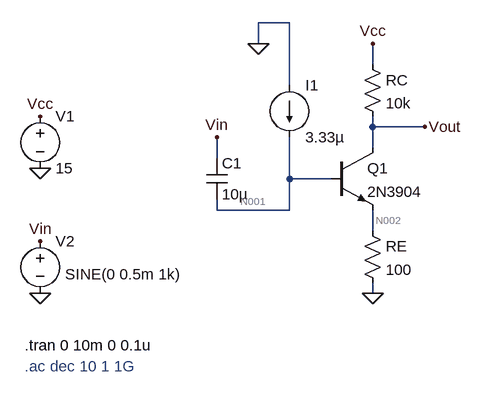
[diagram p0: schematic common_emitter_amplifier.asc]
common_emitter_amplifier.asc, the LTspice schematic file:
Version 4.1
SHEET 1 880 680
WIRE 208 -112 160 -112
WIRE 160 -80 160 -112
WIRE 336 -48 336 -80
WIRE 208 -16 208 -112
WIRE 336 48 336 32
WIRE 416 48 336 48
WIRE 336 80 336 48
WIRE 96 96 96 64
WIRE 208 128 208 64
WIRE 272 128 208 128
WIRE 96 176 96 160
WIRE 208 176 208 128
WIRE 208 176 96 176
WIRE 336 208 336 176
WIRE 336 304 336 288
FLAG -176 224 Vin
FLAG -176 32 Vcc
FLAG -176 304 0
FLAG -176 112 0
FLAG 336 -80 Vcc
FLAG 336 304 0
FLAG 160 -80 0
FLAG 96 64 Vin
FLAG 416 48 Vout
SYMBOL voltage -176 16 R0
WINDOW 123 0 0 Left 0
WINDOW 39 0 0 Left 0
SYMATTR InstName V1
SYMATTR Value 15
SYMBOL voltage -176 208 R0
WINDOW 123 38 117 Left 2
WINDOW 39 0 0 Left 0
WINDOW 3 38 67 Left 2
SYMATTR InstName V2
SYMATTR Value SINE(0 0.5m 1k)
SYMBOL npn 272 80 R0
SYMATTR InstName Q1
SYMATTR Value 2N3904
SYMBOL res 320 -64 R0
SYMATTR InstName RC
SYMATTR Value 10k
SYMBOL current 208 -16 R0
WINDOW 123 0 0 Left 0
WINDOW 39 0 0 Left 0
SYMATTR InstName I1
SYMATTR Value 3.33µ
SYMBOL cap 80 96 R0
SYMATTR InstName C1
SYMATTR Value 10µ
SYMBOL res 320 192 R0
SYMATTR InstName RE
SYMATTR Value 100
TEXT -200 384 Left 2 !.tran 0 10m 0 0.1u
TEXT -200 416 Left 2 ;.ac dec 10 1 1G

The netlist it stands for:
* common_emitter_amplifier.asc
V1 Vcc 0 15
V2 Vin 0 SINE(0 0.5m 1k)
Q1 Vout N001 N002 0 2N3904
RC Vcc Vout 10k
I1 0 N001 3.33µ
C1 Vin N001 10µ
RE N002 0 100
.model NPN NPN
.model PNP PNP
.lib standard.bjt
.tran 0 10m 0 0.1u
* .ac dec 10 1 1G
.backanno
.end

* Results of the author's LTspice run, read from the files saved beside the schematic
* Operating Point, zero values left out:
*   V(n001) = 759.1 mV
*   V(n002) = 103.9 mV
*   V(vcc) = 15 V
*   V(vout) = 4.647 V
*   I(V1) = -1.035 mA
*   Ic(Q1) = 1.035 mA
*   Ib(Q1) = 3.33 µA
*   Ie(Q1) = -1.039 mA
*   I(I1) = 3.33 µA
*   I(RE) = 1.039 mA
*   I(RC) = 1.035 mA
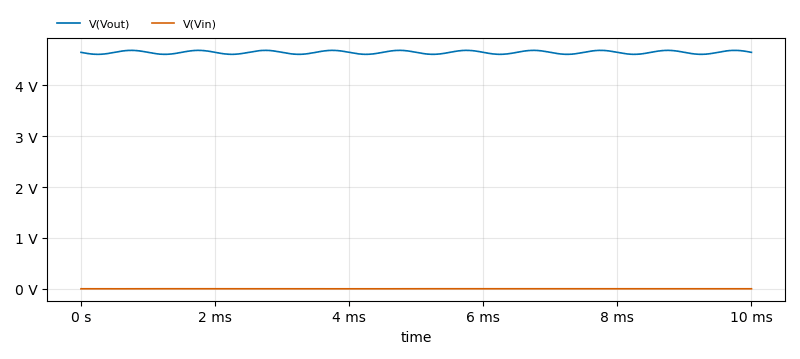
[diagram p1: Transient Analysis of common_emitter_amplifier.asc, plotted from the saved traces]
* Transient Analysis, 1 run:
*   V(Vout): min 4.608 V, max 4.686 V, average 4.647 V, rms 4.647 V, last 4.647 V
*   V(Vin): min -499.9 µV, max 500 µV, average 40.14 nV, rms 357.7 µV, last 0 V